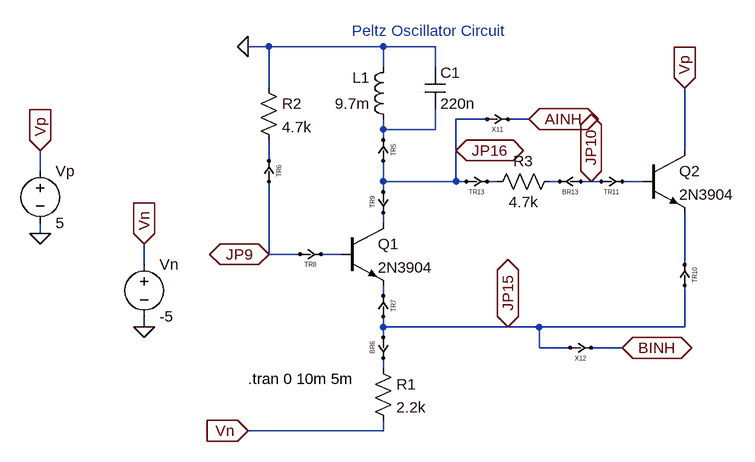
[diagram p0: schematic peltz_lc_osc.asc]
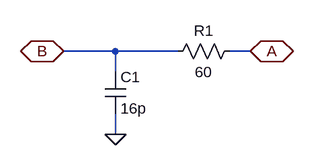
[diagram p1: sub-circuit cross_point.asc]
peltz_lc_osc.asc, the LTspice schematic file:
Version 4
SHEET 1 880 680
WIRE 0 16 -32 16
WIRE 176 16 0 16
WIRE 256 16 176 16
WIRE 176 48 176 16
WIRE 256 48 256 16
WIRE 0 80 0 16
WIRE 336 128 288 128
WIRE 400 128 368 128
WIRE 176 144 176 128
WIRE 256 144 256 112
WIRE 256 144 176 144
WIRE 176 160 176 144
WIRE 288 176 288 128
WIRE 640 176 640 80
WIRE 0 192 0 160
WIRE -352 208 -352 176
WIRE 176 224 176 192
WIRE 288 224 288 176
WIRE 288 224 176 224
WIRE 304 224 288 224
WIRE 352 224 336 224
WIRE 448 224 432 224
WIRE 496 224 480 224
WIRE 512 224 496 224
WIRE 576 224 544 224
WIRE 176 240 176 224
WIRE 176 288 176 272
WIRE -352 304 -352 288
WIRE 0 336 0 224
WIRE 48 336 0 336
WIRE 112 336 80 336
WIRE -192 352 -192 320
WIRE 640 352 640 272
WIRE 176 400 176 384
WIRE -192 448 -192 432
WIRE 176 448 176 432
WIRE 368 448 176 448
WIRE 416 448 368 448
WIRE 640 448 640 384
WIRE 640 448 416 448
WIRE 176 464 176 448
WIRE 416 480 416 448
WIRE 464 480 416 480
WIRE 544 480 496 480
WIRE 176 512 176 496
WIRE 176 608 176 592
WIRE 176 608 -32 608
FLAG 288 176 JP16
IOPIN 288 176 BiDir
FLAG 368 448 JP15
IOPIN 368 448 BiDir
FLAG -32 16 0
FLAG -192 448 0
FLAG -192 320 Vn
IOPIN -192 320 In
FLAG -32 608 Vn
IOPIN -32 608 In
FLAG 0 336 JP9
IOPIN 0 336 BiDir
FLAG 496 224 JP10
IOPIN 496 224 BiDir
FLAG 400 128 AINH
IOPIN 400 128 BiDir
FLAG 544 480 BINH
IOPIN 544 480 BiDir
FLAG -352 304 0
FLAG -352 176 Vp
IOPIN -352 176 In
FLAG 640 80 Vp
IOPIN 640 80 In
SYMBOL res 160 496 R0
SYMATTR InstName R1
SYMATTR Value 2.2k
SYMBOL res -16 64 R0
SYMATTR InstName R2
SYMATTR Value 4.7k
SYMBOL ind 192 144 R180
WINDOW 0 36 80 Left 2
WINDOW 3 36 40 Left 2
SYMATTR InstName L1
SYMATTR Value 9.7m
SYMATTR SpiceLine Rser=28.2
SYMBOL cap 240 48 R0
SYMATTR InstName C1
SYMATTR Value 220n
SYMBOL res 448 208 R90
WINDOW 0 0 56 VBottom 2
WINDOW 3 32 56 VTop 2
SYMATTR InstName R3
SYMATTR Value 4.7k
SYMBOL npn 112 288 R0
SYMATTR InstName Q1
SYMATTR Value 2N3904
SYMBOL npn 576 176 R0
SYMATTR InstName Q2
SYMATTR Value 2N3904
SYMBOL voltage -192 336 R0
SYMATTR InstName Vn
SYMATTR Value -5
SYMBOL cross_point 176 176 R90
SYMATTR InstName TR5
SYMBOL cross_point 320 224 R180
SYMATTR InstName TR13
SYMBOL cross_point 0 208 R90
SYMATTR InstName TR6
SYMBOL cross_point 64 336 R180
SYMATTR InstName TR8
SYMBOL cross_point 640 368 R90
SYMATTR InstName TR10
SYMBOL cross_point 176 480 R270
SYMATTR InstName BR6
SYMBOL cross_point 464 224 M180
SYMATTR InstName BR13
SYMBOL cross_point 528 224 R180
SYMATTR InstName TR11
SYMBOL cross_point 176 416 R90
SYMATTR InstName TR7
SYMBOL cross_point 352 128 R180
SYMATTR InstName X11
SYMBOL cross_point 480 480 R180
SYMATTR InstName X12
SYMBOL cross_point 176 256 R270
SYMATTR InstName TR9
SYMBOL voltage -352 192 R0
SYMATTR InstName Vp
SYMATTR Value 5
TEXT 128 -8 Left 2 ;Peltz Oscillator Circuit
TEXT -32 528 Left 2 !.tran 0 10m 5m

cross_point.asc, the sub-circuit schematic file:
Version 4
SHEET 1 880 680
WIRE 80 160 0 160
WIRE 176 160 80 160
WIRE 288 160 256 160
WIRE 80 192 80 160
WIRE 80 288 80 256
FLAG 288 160 A
IOPIN 288 160 BiDir
FLAG 0 160 B
IOPIN 0 160 BiDir
FLAG 80 288 0
SYMBOL res 272 144 R90
WINDOW 0 0 56 VBottom 2
WINDOW 3 32 56 VTop 2
SYMATTR InstName R1
SYMATTR Value 60
SYMBOL cap 64 192 R0
SYMATTR InstName C1
SYMATTR Value 16p

The netlist it stands for:
* peltz_lc_osc.asc
R1 N010 Vn 2.2k
R2 0 N002 4.7k
L1 N001 0 9.7m Rser=28.2
C1 0 N001 220n
R3 N004 N003 4.7k
Q1 N006 N007 N009 0 2N3904
Q2 Vp N005 N008 0 2N3904
Vn Vn 0 -5
XTR5 JP16 N001 cross_point
XTR13 JP16 N003 cross_point
XTR6 JP9 N002 cross_point
XTR8 JP9 N007 cross_point
XTR10 JP15 N008 cross_point
XBR6 JP15 N010 cross_point
XBR13 JP10 N004 cross_point
XTR11 JP10 N005 cross_point
XTR7 JP15 N009 cross_point
XX11 JP16 AINH cross_point
XX12 JP15 BINH cross_point
XTR9 JP16 N006 cross_point
Vp Vp 0 5

* block symbol definitions
.subckt cross_point A B
R1 A B 60
C1 B 0 16p
.ends cross_point

.model NPN NPN
.model PNP PNP
.lib standard.bjt
* Peltz Oscillator Circuit
.tran 0 10m 5m
.backanno
.end